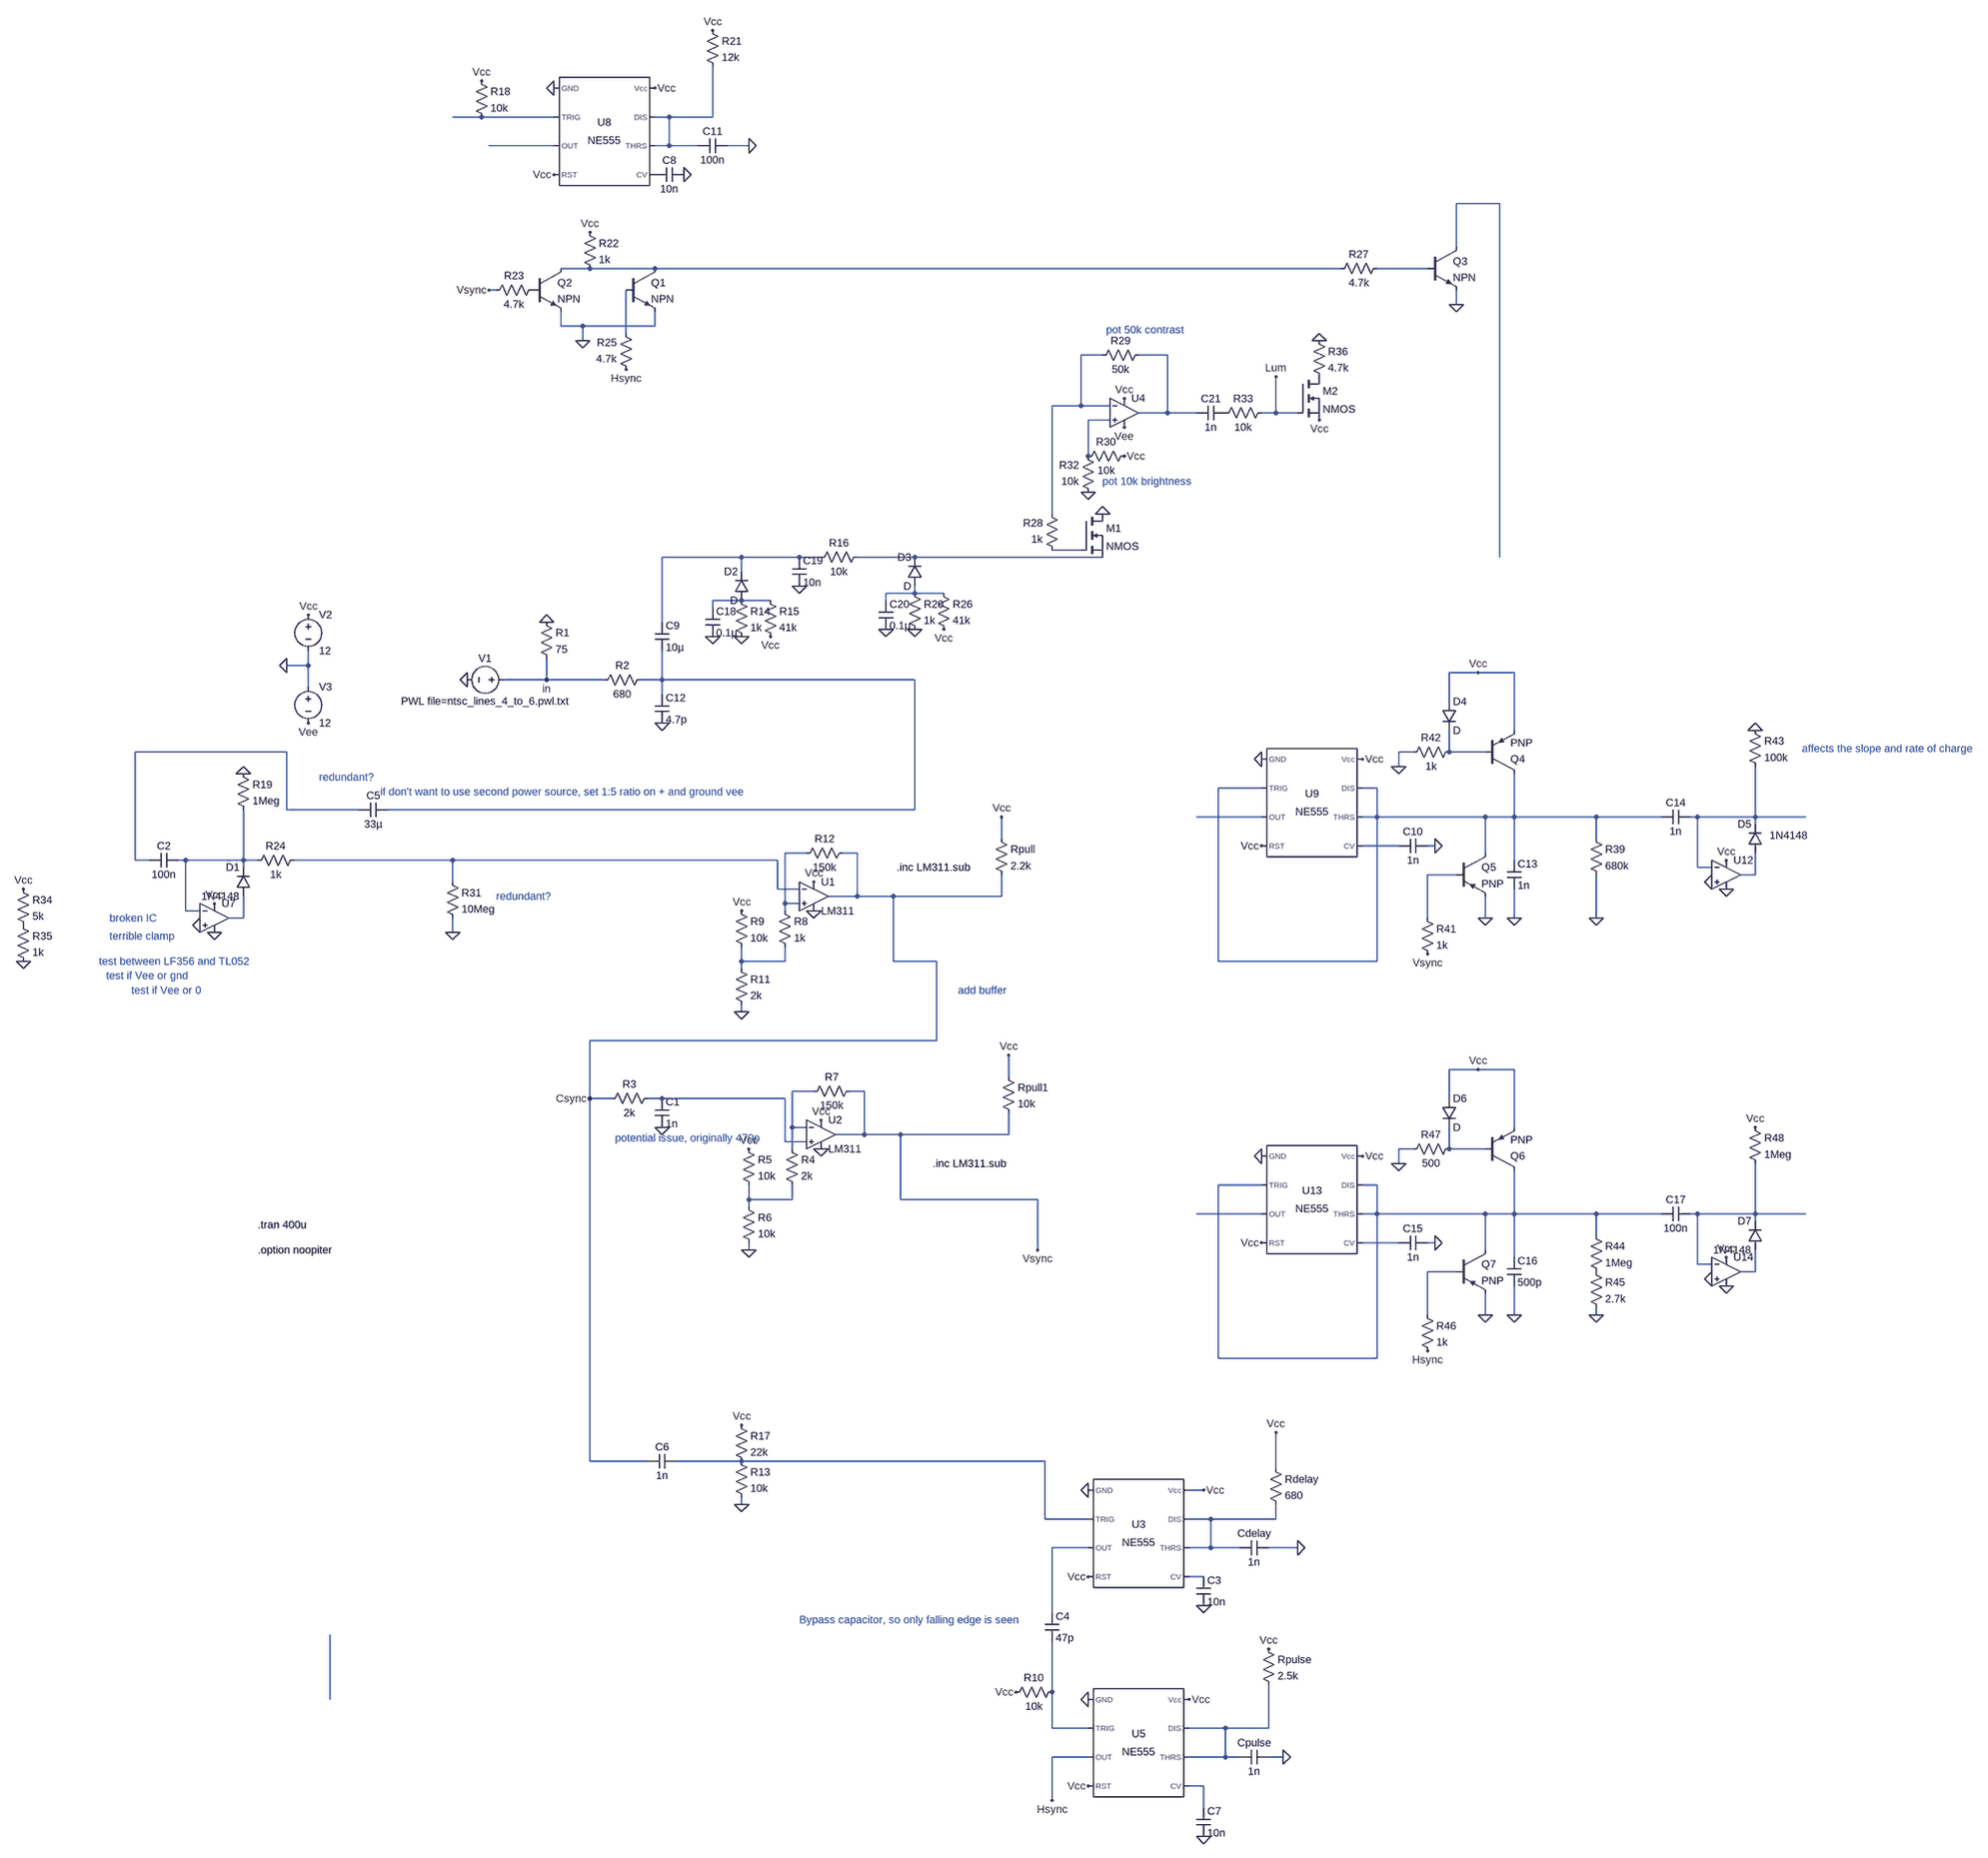
[diagram p0: schematic postFailurebutLum.asc]
postFailurebutLum.asc, the LTspice schematic file:
Version 4
SHEET 1 4812 2948
WIRE 16 -1440 -48 -1440
WIRE 176 -1440 16 -1440
WIRE 432 -1440 400 -1440
WIRE 528 -1440 528 -1552
WIRE 528 -1440 432 -1440
WIRE 176 -1376 32 -1376
WIRE 432 -1376 432 -1440
WIRE 432 -1376 400 -1376
WIRE 496 -1376 432 -1376
WIRE 608 -1376 560 -1376
WIRE 2272 -1248 2176 -1248
WIRE 2176 -1152 2176 -1248
WIRE 256 -1104 192 -1104
WIRE 400 -1104 256 -1104
WIRE 1920 -1104 400 -1104
WIRE 2112 -1104 2000 -1104
WIRE 48 -1056 32 -1056
WIRE 2176 -1024 2176 -1056
WIRE 192 -976 192 -1008
WIRE 240 -976 192 -976
WIRE 400 -976 400 -1008
WIRE 400 -976 240 -976
WIRE 336 -960 336 -1056
WIRE 240 -944 240 -976
WIRE 1392 -912 1344 -912
WIRE 1536 -912 1472 -912
WIRE 1344 -800 1344 -912
WIRE 1344 -800 1280 -800
WIRE 1408 -800 1344 -800
WIRE 1536 -784 1536 -912
WIRE 1536 -784 1472 -784
WIRE 1600 -784 1536 -784
WIRE 1776 -784 1776 -864
WIRE 1776 -784 1744 -784
WIRE 1824 -784 1776 -784
WIRE 1408 -768 1360 -768
WIRE 1360 -688 1360 -768
WIRE 1280 -560 1280 -800
WIRE 1344 -480 1280 -480
WIRE 592 -464 416 -464
WIRE 720 -464 592 -464
WIRE 768 -464 720 -464
WIRE 976 -464 848 -464
WIRE 1392 -464 976 -464
WIRE 2272 -464 2272 -1248
WIRE 592 -432 592 -464
WIRE 976 -384 976 -400
WIRE 976 -384 912 -384
WIRE 1040 -384 976 -384
WIRE 592 -368 528 -368
WIRE 656 -368 592 -368
WIRE 912 -368 912 -384
WIRE 528 -352 528 -368
WIRE 416 -320 416 -464
WIRE -368 -224 -368 -256
WIRE -368 -224 -416 -224
WIRE 2224 -208 2160 -208
WIRE 2304 -208 2224 -208
WIRE 160 -192 160 -240
WIRE 160 -192 64 -192
WIRE 288 -192 160 -192
WIRE 416 -192 416 -256
WIRE 416 -192 368 -192
WIRE 976 -192 416 -192
WIRE -368 -176 -368 -224
WIRE 416 -160 416 -192
WIRE 2160 -144 2160 -208
WIRE 2304 -80 2304 -208
WIRE -416 -32 -752 -32
WIRE 2080 -32 2048 -32
WIRE 2160 -32 2160 -80
WIRE 2240 -32 2160 -32
WIRE 2048 0 2048 -32
WIRE 1744 48 1648 48
WIRE 2000 48 1968 48
WIRE -416 96 -416 -32
WIRE -256 96 -416 96
WIRE 976 96 976 -192
WIRE 976 96 -192 96
WIRE 1744 112 1600 112
WIRE 2000 112 2000 48
WIRE 2000 112 1968 112
WIRE 2240 112 2000 112
WIRE 2304 112 2304 16
WIRE 2304 112 2240 112
WIRE 2496 112 2304 112
WIRE 2640 112 2496 112
WIRE 2720 112 2704 112
WIRE 2848 112 2848 0
WIRE 2848 112 2720 112
WIRE 2960 112 2848 112
WIRE 2848 128 2848 112
WIRE 1168 160 1168 112
WIRE 2496 160 2496 112
WIRE 2048 176 1968 176
WIRE 2128 176 2112 176
WIRE 736 192 688 192
WIRE 848 192 816 192
WIRE 2240 192 2240 112
WIRE -752 208 -752 -32
WIRE -720 208 -752 208
WIRE -640 208 -656 208
WIRE -512 208 -512 96
WIRE -512 208 -640 208
WIRE -480 208 -512 208
WIRE -48 208 -400 208
WIRE 672 208 -48 208
WIRE 2304 208 2304 112
WIRE -512 224 -512 208
WIRE 2720 224 2720 112
WIRE 2752 224 2720 224
WIRE 2176 240 2112 240
WIRE 2848 240 2848 192
WIRE 2848 240 2816 240
WIRE -48 256 -48 208
WIRE 672 272 672 208
WIRE 720 272 672 272
WIRE 848 288 848 192
WIRE 848 288 784 288
WIRE 928 288 848 288
WIRE 1168 288 1168 240
WIRE 1168 288 928 288
WIRE 688 304 688 192
WIRE 720 304 688 304
WIRE -640 320 -640 208
WIRE -608 320 -640 320
WIRE 688 320 688 304
WIRE -512 336 -512 288
WIRE -512 336 -544 336
WIRE 2112 336 2112 240
WIRE 2240 336 2240 288
WIRE 2304 336 2304 272
WIRE 2496 336 2496 240
WIRE -48 368 -48 336
WIRE 592 432 592 400
WIRE 688 432 688 400
WIRE 688 432 592 432
WIRE 928 432 928 288
WIRE 1024 432 928 432
WIRE 1648 432 1648 48
WIRE 2000 432 2000 112
WIRE 2000 432 1648 432
WIRE 592 448 592 432
WIRE 592 544 592 528
WIRE 1024 608 1024 432
WIRE 1024 608 256 608
WIRE 2224 672 2160 672
WIRE 2304 672 2224 672
WIRE 1184 688 1184 640
WIRE 752 720 704 720
WIRE 864 720 832 720
WIRE 256 736 256 608
WIRE 304 736 256 736
WIRE 416 736 384 736
WIRE 688 736 416 736
WIRE 2160 736 2160 672
WIRE 704 800 704 720
WIRE 736 800 704 800
WIRE 2304 800 2304 672
WIRE 864 816 864 720
WIRE 864 816 800 816
WIRE 944 816 864 816
WIRE 1184 816 1184 768
WIRE 1184 816 944 816
WIRE 688 832 688 736
WIRE 736 832 688 832
WIRE 704 848 704 800
WIRE 2080 848 2048 848
WIRE 2160 848 2160 800
WIRE 2240 848 2160 848
WIRE 2048 880 2048 848
WIRE 1744 928 1648 928
WIRE 2000 928 1968 928
WIRE 608 960 608 928
WIRE 704 960 704 928
WIRE 704 960 608 960
WIRE 944 960 944 816
WIRE 1248 960 944 960
WIRE 608 976 608 960
WIRE 1744 992 1600 992
WIRE 2000 992 2000 928
WIRE 2000 992 1968 992
WIRE 2240 992 2000 992
WIRE 2304 992 2304 896
WIRE 2304 992 2240 992
WIRE 2496 992 2304 992
WIRE 2640 992 2496 992
WIRE 2720 992 2704 992
WIRE 2848 992 2848 880
WIRE 2848 992 2720 992
WIRE 2960 992 2848 992
WIRE 2848 1008 2848 992
WIRE 2496 1040 2496 992
WIRE 2048 1056 1968 1056
WIRE 2128 1056 2112 1056
WIRE 608 1072 608 1056
WIRE 1248 1072 1248 960
WIRE 2240 1072 2240 992
WIRE 2304 1088 2304 992
WIRE 2720 1104 2720 992
WIRE 2752 1104 2720 1104
WIRE 2176 1120 2112 1120
WIRE 2848 1120 2848 1072
WIRE 2848 1120 2816 1120
WIRE 2112 1216 2112 1120
WIRE 2240 1216 2240 1168
WIRE 2304 1216 2304 1152
WIRE 2496 1216 2496 1200
WIRE 1648 1312 1648 928
WIRE 2000 1312 2000 992
WIRE 2000 1312 1648 1312
WIRE 256 1632 256 736
WIRE 384 1632 256 1632
WIRE 592 1632 448 1632
WIRE 1264 1632 592 1632
WIRE 1776 1648 1776 1568
WIRE 1616 1696 1584 1696
WIRE 592 1728 592 1712
WIRE 1264 1760 1264 1632
WIRE 1360 1760 1264 1760
WIRE 1632 1760 1584 1760
WIRE 1776 1760 1776 1728
WIRE 1776 1760 1632 1760
WIRE 1360 1824 1280 1824
WIRE 1632 1824 1632 1760
WIRE 1632 1824 1584 1824
WIRE 1696 1824 1632 1824
WIRE 1824 1824 1760 1824
WIRE 1616 1888 1584 1888
WIRE 1280 1968 1280 1824
WIRE 1280 2144 1280 2032
WIRE -320 2160 -320 2016
WIRE 1280 2224 1280 2144
WIRE 1360 2224 1280 2224
WIRE 1664 2224 1584 2224
WIRE 1760 2224 1760 2128
WIRE 1760 2224 1664 2224
WIRE 1360 2288 1280 2288
WIRE 1664 2288 1664 2224
WIRE 1664 2288 1584 2288
WIRE 1696 2288 1664 2288
WIRE 1792 2288 1760 2288
WIRE 1616 2352 1584 2352
WIRE 1280 2384 1280 2288
WIRE 1616 2400 1616 2352
FLAG -16 -192 0
FLAG 160 -320 0
FLAG 416 -96 0
FLAG 592 544 0
FLAG 752 256 Vcc
FLAG -368 -336 Vcc
FLAG -368 -96 Vee
FLAG -416 -224 0
FLAG 1168 112 Vcc
FLAG 592 320 Vcc
FLAG -48 368 0
FLAG 416 800 0
FLAG -576 304 Vcc
FLAG 608 1072 0
FLAG 1184 640 Vcc
FLAG 608 848 Vcc
FLAG 768 848 0
FLAG 1248 1072 Vsync
FLAG 256 736 Csync
FLAG 1360 1696 0
FLAG 1360 1888 Vcc
FLAG -1056 432 0
FLAG -1056 272 Vcc
FLAG -608 352 0
FLAG 160 -192 in
FLAG 768 784 Vcc
FLAG -576 368 0
FLAG 752 320 0
FLAG -512 16 0
FLAG 1616 1696 Vcc
FLAG 1776 1568 Vcc
FLAG 1824 1824 0
FLAG 1616 1952 0
FLAG 1200 2144 Vcc
FLAG 1360 2160 0
FLAG 1584 2160 Vcc
FLAG 1760 2048 Vcc
FLAG 1792 2288 0
FLAG 1360 2352 Vcc
FLAG 1280 2384 Hsync
FLAG 1616 2464 0
FLAG 592 1552 Vcc
FLAG 592 1728 0
FLAG 176 -1504 0
FLAG 400 -1504 Vcc
FLAG 176 -1312 Vcc
FLAG 16 -1520 Vcc
FLAG 464 -1312 0
FLAG 528 -1632 Vcc
FLAG 608 -1376 0
FLAG 2176 -1024 0
FLAG 1744 -16 0
FLAG 1744 176 Vcc
FLAG 1968 -16 Vcc
FLAG 2128 176 0
FLAG 2304 336 0
FLAG 2224 -208 Vcc
FLAG 2496 336 0
FLAG 2240 336 0
FLAG 2048 0 0
FLAG 2784 208 Vcc
FLAG 2752 256 0
FLAG 2784 272 0
FLAG 1744 864 0
FLAG 1744 1056 Vcc
FLAG 1968 864 Vcc
FLAG 2128 1056 0
FLAG 2304 1216 0
FLAG 2224 672 Vcc
FLAG 2496 1216 0
FLAG 2240 1216 0
FLAG 2112 1296 Hsync
FLAG 2048 880 0
FLAG 2784 1088 Vcc
FLAG 2752 1136 0
FLAG 2784 1152 0
FLAG 2112 416 Vsync
FLAG 2848 -80 0
FLAG 2848 800 Vcc
FLAG 528 -288 0
FLAG 592 -288 0
FLAG 656 -288 Vcc
FLAG 720 -400 0
FLAG 912 -304 0
FLAG 976 -304 0
FLAG 1040 -304 Vcc
FLAG 1360 -608 0
FLAG 1440 -688 Vcc
FLAG 1440 -752 Vee
FLAG 1440 -816 Vcc
FLAG 1872 -768 Vcc
FLAG 1872 -944 0
FLAG 1776 -864 Lum
FLAG 1392 -560 0
FLAG 32 -1056 Vsync
FLAG 240 -944 0
FLAG 256 -1184 Vcc
FLAG 336 -880 Hsync
DATAFLAG 592 432 ""
DATAFLAG 608 960 ""
DATAFLAG 1248 960 ""
SYMBOL voltage 80 -192 R90
WINDOW 0 -32 56 VBottom 2
WINDOW 3 32 56 VTop 2
WINDOW 123 0 0 Left 0
WINDOW 39 0 0 Left 0
SYMATTR InstName V1
SYMATTR Value PWL file=ntsc_lines_4_to_6.pwl.txt
SYMBOL res 144 -336 R0
SYMATTR InstName R1
SYMATTR Value 75
SYMBOL res 384 -208 R90
WINDOW 0 0 56 VBottom 2
WINDOW 3 32 56 VTop 2
SYMATTR InstName R2
SYMATTR Value 680
SYMBOL cap 400 -160 R0
SYMATTR InstName C12
SYMATTR Value 4.7p
SYMBOL res 672 304 R0
SYMATTR InstName R8
SYMATTR Value 1k
SYMBOL res 576 304 R0
SYMATTR InstName R9
SYMATTR Value 10k
SYMBOL res 576 432 R0
SYMATTR InstName R11
SYMATTR Value 2k
SYMBOL res 832 176 R90
WINDOW 0 0 56 VBottom 2
WINDOW 3 32 56 VTop 2
SYMATTR InstName R12
SYMATTR Value 150k
SYMBOL res 1152 144 R0
SYMATTR InstName Rpull
SYMATTR Value 2.2k
SYMBOL voltage -368 -352 R0
SYMATTR InstName V2
SYMATTR Value 12
SYMBOL voltage -368 -192 R0
SYMATTR InstName V3
SYMATTR Value 12
SYMBOL OpAmps\\opamp2 752 224 R0
SYMATTR InstName U1
SYMATTR Value LM311
SYMBOL res -64 240 R0
SYMATTR InstName R31
SYMATTR Value 10Meg
SYMBOL res 400 720 R90
WINDOW 0 0 56 VBottom 2
WINDOW 3 32 56 VTop 2
SYMATTR InstName R3
SYMATTR Value 2k
SYMBOL cap 400 736 R0
SYMATTR InstName C1
SYMATTR Value 1n
SYMBOL res -384 192 R90
WINDOW 0 0 56 VBottom 2
WINDOW 3 32 56 VTop 2
SYMATTR InstName R24
SYMATTR Value 1k
SYMBOL diode -496 288 R180
WINDOW 0 24 64 Left 2
WINDOW 3 24 0 Left 2
SYMATTR InstName D1
SYMATTR Value 1N4148
SYMBOL cap -656 192 R90
WINDOW 0 0 32 VBottom 2
WINDOW 3 32 32 VTop 2
SYMATTR InstName C2
SYMATTR Value 100n
SYMBOL OpAmps\\UniversalOpAmp2 -576 336 R0
SYMATTR InstName U7
SYMBOL res 688 832 R0
SYMATTR InstName R4
SYMATTR Value 2k
SYMBOL res 592 832 R0
SYMATTR InstName R5
SYMATTR Value 10k
SYMBOL res 592 960 R0
SYMATTR InstName R6
SYMATTR Value 10k
SYMBOL res 848 704 R90
WINDOW 0 0 56 VBottom 2
WINDOW 3 32 56 VTop 2
SYMATTR InstName R7
SYMATTR Value 150k
SYMBOL res 1168 672 R0
SYMATTR InstName Rpull1
SYMATTR Value 10k
SYMBOL OpAmps\\opamp2 768 752 R0
SYMATTR InstName U2
SYMATTR Value LM311
SYMBOL Misc\\NE555 1472 1792 R0
SYMATTR InstName U3
SYMBOL res -1072 256 R0
SYMATTR InstName R34
SYMATTR Value 5k
SYMBOL res -1072 336 R0
SYMATTR InstName R35
SYMATTR Value 1k
SYMBOL res -528 0 R0
SYMATTR InstName R19
SYMATTR Value 1Meg
SYMBOL cap -192 80 R90
WINDOW 0 0 32 VBottom 2
WINDOW 3 32 32 VTop 2
SYMATTR InstName C5
SYMATTR Value 33µ
SYMBOL res 1760 1632 R0
SYMATTR InstName Rdelay
SYMATTR Value 680
SYMBOL cap 1760 1808 R90
WINDOW 0 0 32 VBottom 2
WINDOW 3 32 32 VTop 2
SYMATTR InstName Cdelay
SYMATTR Value 1n
SYMBOL cap 1600 1888 R0
SYMATTR InstName C3
SYMATTR Value 10n
SYMBOL cap 1264 1968 R0
SYMATTR InstName C4
SYMATTR Value 47p
SYMBOL res 1296 2128 R90
WINDOW 0 0 56 VBottom 2
WINDOW 3 32 56 VTop 2
SYMATTR InstName R10
SYMATTR Value 10k
SYMBOL Misc\\NE555 1472 2256 R0
SYMATTR InstName U5
SYMBOL res 1744 2032 R0
SYMATTR InstName Rpulse
SYMATTR Value 2.5k
SYMBOL cap 1760 2272 R90
WINDOW 0 0 32 VBottom 2
WINDOW 3 32 32 VTop 2
SYMATTR InstName Cpulse
SYMATTR Value 1n
SYMBOL cap 1600 2400 R0
SYMATTR InstName C7
SYMATTR Value 10n
SYMBOL res 576 1616 R0
SYMATTR InstName R13
SYMATTR Value 10k
SYMBOL cap 448 1616 R90
WINDOW 0 0 32 VBottom 2
WINDOW 3 32 32 VTop 2
SYMATTR InstName C6
SYMATTR Value 1n
SYMBOL res 576 1536 R0
SYMATTR InstName R17
SYMATTR Value 22k
SYMBOL Misc\\NE555 288 -1408 R0
SYMATTR InstName U8
SYMBOL res 0 -1536 R0
SYMATTR InstName R18
SYMATTR Value 10k
SYMBOL cap 464 -1328 R90
WINDOW 0 0 32 VBottom 2
WINDOW 3 32 32 VTop 2
SYMATTR InstName C8
SYMATTR Value 10n
SYMBOL res 512 -1648 R0
SYMATTR InstName R21
SYMATTR Value 12k
SYMBOL cap 560 -1392 R90
WINDOW 0 0 32 VBottom 2
WINDOW 3 32 32 VTop 2
SYMATTR InstName C11
SYMATTR Value 100n
SYMBOL npn 2112 -1152 R0
SYMATTR InstName Q3
SYMBOL res 2016 -1120 R90
WINDOW 0 0 56 VBottom 2
WINDOW 3 32 56 VTop 2
SYMATTR InstName R27
SYMATTR Value 4.7k
SYMBOL Misc\\NE555 1856 80 R0
SYMATTR InstName U9
SYMBOL cap 2112 160 R90
WINDOW 0 0 32 VBottom 2
WINDOW 3 32 32 VTop 2
SYMATTR InstName C10
SYMATTR Value 1n
SYMBOL cap 2288 208 R0
SYMATTR InstName C13
SYMATTR Value 1n
SYMBOL pnp 2240 16 M180
SYMATTR InstName Q4
SYMBOL diode 2144 -144 R0
SYMATTR InstName D4
SYMBOL res 2480 144 R0
SYMATTR InstName R39
SYMATTR Value 680k
SYMBOL res 2096 320 R0
SYMATTR InstName R41
SYMATTR Value 1k
SYMBOL res 2176 -48 R90
WINDOW 0 0 56 VBottom 2
WINDOW 3 32 56 VTop 2
SYMATTR InstName R42
SYMATTR Value 1k
SYMBOL pnp 2176 192 R0
SYMATTR InstName Q5
SYMBOL diode 2864 192 R180
WINDOW 0 24 64 Left 2
WINDOW 3 -101 39 Left 2
SYMATTR InstName D5
SYMATTR Value 1N4148
SYMBOL cap 2704 96 R90
WINDOW 0 0 32 VBottom 2
WINDOW 3 32 32 VTop 2
SYMATTR InstName C14
SYMATTR Value 1n
SYMBOL OpAmps\\UniversalOpAmp2 2784 240 R0
SYMATTR InstName U12
SYMBOL res 2832 -96 R0
SYMATTR InstName R43
SYMATTR Value 100k
SYMBOL Misc\\NE555 1856 960 R0
SYMATTR InstName U13
SYMBOL cap 2112 1040 R90
WINDOW 0 0 32 VBottom 2
WINDOW 3 32 32 VTop 2
SYMATTR InstName C15
SYMATTR Value 1n
SYMBOL cap 2288 1088 R0
SYMATTR InstName C16
SYMATTR Value 500p
SYMBOL pnp 2240 896 M180
SYMATTR InstName Q6
SYMBOL diode 2144 736 R0
SYMATTR InstName D6
SYMBOL res 2480 1024 R0
SYMATTR InstName R44
SYMATTR Value 1Meg
SYMBOL res 2480 1104 R0
SYMATTR InstName R45
SYMATTR Value 2.7k
SYMBOL res 2096 1200 R0
SYMATTR InstName R46
SYMATTR Value 1k
SYMBOL res 2176 832 R90
WINDOW 0 0 56 VBottom 2
WINDOW 3 32 56 VTop 2
SYMATTR InstName R47
SYMATTR Value 500
SYMBOL pnp 2176 1072 R0
SYMATTR InstName Q7
SYMBOL diode 2864 1072 R180
WINDOW 0 24 64 Left 2
WINDOW 3 24 0 Left 2
SYMATTR InstName D7
SYMATTR Value 1N4148
SYMBOL cap 2704 976 R90
WINDOW 0 0 32 VBottom 2
WINDOW 3 32 32 VTop 2
SYMATTR InstName C17
SYMATTR Value 100n
SYMBOL OpAmps\\UniversalOpAmp2 2784 1120 R0
SYMATTR InstName U14
SYMBOL res 2832 784 R0
SYMATTR InstName R48
SYMATTR Value 1Meg
SYMBOL cap 400 -320 R0
SYMATTR InstName C9
SYMATTR Value 10µ
SYMBOL diode 608 -368 R180
WINDOW 0 24 64 Left 2
WINDOW 3 24 0 Left 2
SYMATTR InstName D2
SYMBOL res 576 -384 R0
SYMATTR InstName R14
SYMATTR Value 1k
SYMBOL res 640 -384 R0
SYMATTR InstName R15
SYMATTR Value 41k
SYMBOL cap 512 -352 R0
SYMATTR InstName C18
SYMATTR Value 0.1µ
SYMBOL cap 704 -464 R0
SYMATTR InstName C19
SYMATTR Value 10n
SYMBOL res 864 -480 R90
WINDOW 0 0 56 VBottom 2
WINDOW 3 32 56 VTop 2
SYMATTR InstName R16
SYMATTR Value 10k
SYMBOL res 960 -400 R0
SYMATTR InstName R20
SYMATTR Value 1k
SYMBOL res 1024 -400 R0
SYMATTR InstName R26
SYMATTR Value 41k
SYMBOL cap 896 -368 R0
SYMATTR InstName C20
SYMATTR Value 0.1µ
SYMBOL diode 992 -400 R180
WINDOW 0 24 64 Left 2
WINDOW 3 24 0 Left 2
SYMATTR InstName D3
SYMBOL nmos 1344 -560 R0
SYMATTR InstName M1
SYMBOL res 1296 -464 R180
WINDOW 0 36 76 Left 2
WINDOW 3 36 40 Left 2
SYMATTR InstName R28
SYMATTR Value 1k
SYMBOL OpAmps\\UniversalOpAmp2 1440 -784 R0
SYMATTR InstName U4
SYMBOL res 1488 -928 R90
WINDOW 0 0 56 VBottom 2
WINDOW 3 32 56 VTop 2
SYMATTR InstName R29
SYMATTR Value 50k
SYMBOL res 1456 -704 R90
WINDOW 0 0 56 VBottom 2
WINDOW 3 32 56 VTop 2
SYMATTR InstName R30
SYMATTR Value 10k
SYMBOL res 1376 -592 R180
WINDOW 0 36 76 Left 2
WINDOW 3 36 40 Left 2
SYMATTR InstName R32
SYMATTR Value 10k
SYMBOL cap 1664 -800 R90
WINDOW 0 0 32 VBottom 2
WINDOW 3 32 32 VTop 2
SYMATTR InstName C21
SYMATTR Value 1n
SYMBOL res 1760 -800 R90
WINDOW 0 0 56 VBottom 2
WINDOW 3 32 56 VTop 2
SYMATTR InstName R33
SYMATTR Value 10k
SYMBOL nmos 1824 -864 R0
SYMATTR InstName M2
SYMBOL res 1856 -960 R0
SYMATTR InstName R36
SYMATTR Value 4.7k
SYMBOL npn 336 -1104 R0
SYMATTR InstName Q1
SYMBOL npn 128 -1104 R0
SYMATTR InstName Q2
SYMBOL res 240 -1200 R0
SYMATTR InstName R22
SYMATTR Value 1k
SYMBOL res 144 -1072 R90
WINDOW 0 0 56 VBottom 2
WINDOW 3 32 56 VTop 2
SYMATTR InstName R23
SYMATTR Value 4.7k
SYMBOL res 352 -864 R180
WINDOW 0 36 76 Left 2
WINDOW 3 36 40 Left 2
SYMATTR InstName R25
SYMATTR Value 4.7k
TEXT -480 1016 Left 2 !.tran 400u
TEXT 936 224 Left 2 !.inc LM311.sub
TEXT 1016 880 Left 2 !.inc LM311.sub
TEXT -208 56 Left 2 ;if don't want to use second power source, set 1:5 ratio on + and ground vee
TEXT -808 336 Left 2 ;broken IC
TEXT -808 376 Left 2 ;terrible clamp
TEXT -832 432 Left 2 ;test between LF356 and TL052
TEXT 48 288 Left 2 ;redundant?
TEXT -344 24 Left 2 ;redundant?
TEXT -816 464 Left 2 ;test if Vee or gnd
TEXT 720 1984 Left 2 ;Bypass capacitor, so only falling edge is seen
TEXT -480 1072 Left 2 !.option noopiter
TEXT 1072 496 Left 2 ;add buffer
TEXT -760 496 Left 2 ;test if Vee or 0
TEXT 312 824 Left 2 ;potential issue, originally 470p
TEXT 2952 -40 Left 2 ;affects the slope and rate of charge
TEXT 1400 -968 Left 2 ;pot 50k contrast
TEXT 1392 -632 Left 2 ;pot 10k brightness

The netlist it stands for:
* postFailurebutLum.asc
V1 in 0 PWL file=ntsc_lines_4_to_6.pwl.txt
R1 0 in 75
R2 N016 in 680
C12 N016 0 4.7p
R8 N023 N029 1k
R9 Vcc N029 10k
R11 N029 0 2k
R12 Csync N023 150k
Rpull Vcc Csync 2.2k
V2 Vcc 0 12
V3 0 Vee 12
XU1 N023 N025 Vcc 0 Csync LM311  ; pins In+ In- V+ V- OUT
R31 N025 0 10Meg
R3 N031 Csync 2k
C1 N031 0 1n
R24 N025 N024 1k
D1 N028 N024 1N4148
C2 N024 N017 100n
XU7 0 N024 Vcc 0 N028 level2 Avol=1Meg GBW=10Meg Slew=10Meg Ilimit=25m Rail=0 Vos=0 En=0 Enk=0 In=0 Ink=0 Rin=500Meg  ; pins In+ In- V+ V- OUT
R4 N030 N034 2k
R5 Vcc N034 10k
R6 N034 0 10k
R7 Vsync N030 150k
Rpull1 Vcc Vsync 10k
XU2 N031 N030 Vcc 0 Vsync LM311  ; pins In+ In- V+ V- OUT
XU3 0 N040 N042 Vcc N043 N041 N041 Vcc NE555  ; pins GND TRIG OUT RST CV THRS DIS Vcc
R34 Vcc P001 5k
R35 P001 0 1k
R19 0 N024 1Meg
C5 N016 N017 33µ
Rdelay Vcc N041 680
Cdelay 0 N041 1n
C3 N043 0 10n
C4 N042 N044 47p
R10 N044 Vcc 10k
XU5 0 N044 Hsync Vcc N047 N046 N046 Vcc NE555  ; pins GND TRIG OUT RST CV THRS DIS Vcc
Rpulse Vcc N046 2.5k
Cpulse 0 N046 1n
C7 N047 0 10n
R13 N040 0 10k
C6 N040 Csync 1n
R17 Vcc N040 22k
XU8 0 N001 N003 Vcc P002 N002 N002 Vcc NE555  ; pins GND TRIG OUT RST CV THRS DIS Vcc
R18 Vcc N001 10k
C8 0 P002 10n
R21 Vcc N002 12k
C11 0 N002 100n
Q3 N004 N006 0 0 NPN
R27 N006 N005 4.7k
XU9 0 N019 N020 Vcc N022 N019 N019 Vcc NE555  ; pins GND TRIG OUT RST CV THRS DIS Vcc
C10 0 N022 1n
C13 N019 0 1n
Q4 N019 N018 Vcc 0 PNP
D4 Vcc N018 D
R39 N019 0 680k
R41 N026 Vsync 1k
R42 N018 0 1k
Q5 N019 N026 0 0 PNP
D5 N027 N021 1N4148
C14 N021 N019 1n
XU12 0 N021 Vcc 0 N027 level2 Avol=1Meg GBW=10Meg Slew=10Meg Ilimit=25m Rail=0 Vos=0 En=0 Enk=0 In=0 Ink=0 Rin=500Meg  ; pins In+ In- V+ V- OUT
R43 0 N021 100k
XU13 0 N033 N035 Vcc N037 N033 N033 Vcc NE555  ; pins GND TRIG OUT RST CV THRS DIS Vcc
C15 0 N037 1n
C16 N033 0 500p
Q6 N033 N032 Vcc 0 PNP
D6 Vcc N032 D
R44 N033 P003 1Meg
R45 P003 0 2.7k
R46 N038 Hsync 1k
R47 N032 0 500
Q7 N033 N038 0 0 PNP
D7 N039 N036 1N4148
C17 N036 N033 100n
XU14 0 N036 Vcc 0 N039 level2 Avol=1Meg GBW=10Meg Slew=10Meg Ilimit=25m Rail=0 Vos=0 En=0 Enk=0 In=0 Ink=0 Rin=500Meg  ; pins In+ In- V+ V- OUT
R48 Vcc N036 1Meg
C9 N012 N016 10µ
D2 N015 N012 D
R14 N015 0 1k
R15 N015 Vcc 41k
C18 N015 0 0.1µ
C19 N012 0 10n
R16 N013 N012 10k
R20 N014 0 1k
R26 N014 Vcc 41k
C20 N014 0 0.1µ
D3 N014 N013 D
M1 0 N011 N013 N013 NMOS
R28 N011 N008 1k
XU4 N010 N008 Vcc Vee N009 level2 Avol=1Meg GBW=10Meg Slew=10Meg Ilimit=25m Rail=0 Vos=0 En=0 Enk=0 In=0 Ink=0 Rin=500Meg  ; pins In+ In- V+ V- OUT
R29 N009 N008 50k
R30 Vcc N010 10k
R32 0 N010 10k
C21 P004 N009 1n
R33 Lum P004 10k
M2 P005 Lum Vcc Vcc NMOS
R36 0 P005 4.7k
Q1 N005 N007 0 0 NPN
Q2 N005 P006 0 0 NPN
R22 Vcc N005 1k
R23 P006 Vsync 4.7k
R25 Hsync N007 4.7k
.model D D
.lib standard.dio
.model NPN NPN
.model PNP PNP
.lib standard.bjt
.model NMOS NMOS
.model PMOS PMOS
.lib standard.mos
.tran 400u
.inc LM311.sub
.inc LM311.sub
* if don't want to use second power source, set 1:5 ratio on + and ground vee
* broken IC
* terrible clamp
* test between LF356 and TL052
* redundant?
* redundant?
* test if Vee or gnd
* Bypass capacitor, so only falling edge is seen
.option noopiter
* add buffer
* test if Vee or 0
* potential issue, originally 470p
* affects the slope and rate of charge
* pot 50k contrast
* pot 10k brightness
.lib UniversalOpAmp2.lib
.lib NE555.sub
.backanno
.end